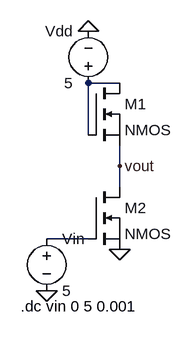
[diagram p0: schematic Draft2.asc]
Draft2.asc, the LTspice schematic file:
Version 4.1
SHEET 1 880 680
WIRE 208 64 160 64
WIRE 160 144 160 64
WIRE 208 192 208 160
WIRE 208 224 208 192
WIRE 160 304 96 304
FLAG 208 320 0
FLAG 208 192 vout
FLAG 96 384 0
FLAG 160 -16 0
SYMBOL nmos 160 64 R0
SYMATTR InstName M1
SYMBOL nmos 160 224 R0
SYMATTR InstName M2
SYMBOL voltage 160 80 R180
WINDOW 0 24 96 Left 2
WINDOW 3 24 16 Left 2
SYMATTR InstName Vdd
SYMATTR Value 5
SYMBOL voltage 96 288 R0
WINDOW 123 0 0 Left 0
WINDOW 39 0 0 Left 0
SYMATTR InstName Vin
SYMATTR Value 5
TEXT 56 408 Left 2 !.dc vin 0 5 0.001

The netlist it stands for:
* Draft2.asc
M1 N001 N001 vout vout NMOS
M2 vout N002 0 0 NMOS
Vdd N001 0 5
Vin N002 0 5
.model NMOS NMOS
.model PMOS PMOS
.lib standard.mos
.dc vin 0 5 0.001
.backanno
.end